# Altium schematic sheet Светодиоды.SchDoc
size 209 x 297 mm; Scale: 1:1; DocumentType: Схема электрическая принципиальная; FirstReferrence: АБВГ.123456.001
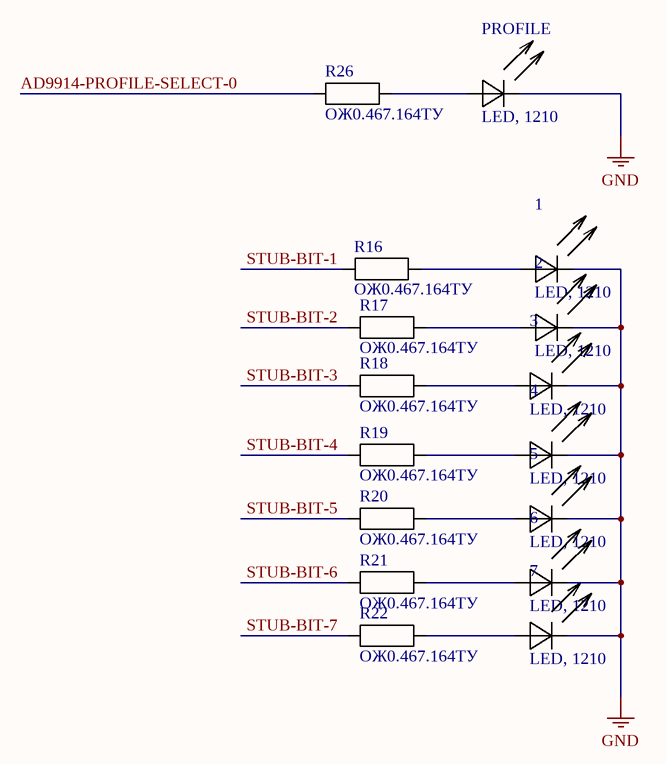
[diagram p0: Светодиоды.SchDoc]

## Parts
1  LED, 1210  [PLCC4-1210]
2  LED, 1210  [PLCC4-1210]
3  LED, 1210  [PLCC4-1210]
4  LED, 1210  [PLCC4-1210]
5  LED, 1210  [PLCC4-1210]
6  LED, 1210  [PLCC4-1210]
7  LED, 1210  [PLCC4-1210]
PROFILE  LED, 1210  [PLCC4-1210]
R16  ОЖ0.467.164ТУ  [Р1-8МП-0,125]
R17  ОЖ0.467.164ТУ  [Р1-8МП-0,125]
R18  ОЖ0.467.164ТУ  [Р1-8МП-0,125]
R19  ОЖ0.467.164ТУ  [Р1-8МП-0,125]
R20  ОЖ0.467.164ТУ  [Р1-8МП-0,125]
R21  ОЖ0.467.164ТУ  [Р1-8МП-0,125]
R22  ОЖ0.467.164ТУ  [Р1-8МП-0,125]
R26  ОЖ0.467.164ТУ  [Р1-8МП-0,125]

## Nets
GND: 1.2 2.2 3.2 4.2 5.2 6.2 7.2 PROFILE.2
AD9914-PROFILE-SELECT-0: R26.1
STUB-BIT-1: R16.1
STUB-BIT-2: R17.1
STUB-BIT-3: R18.1
STUB-BIT-4: R19.1
STUB-BIT-5: R20.1
STUB-BIT-6: R21.1
STUB-BIT-7: R22.1
Net1_1: 1.1 R16.2
Net2_1: 2.1 R17.2
Net3_1: 3.1 R18.2
Net4_1: 4.1 R19.2
Net5_1: 5.1 R20.2
Net6_1: 6.1 R21.2
Net7_1: 7.1 R22.2
NetPROFILE_1: PROFILE.1 R26.2

## Notes on the sheet
- Перв. примен.
- Справ. №
- Подп. и дата
- Инв. № дубл.
- Взам. инв. №
- Разраб.
- Изм.
- Лист
- № докум.
- Подп.
- Дата
- Лит.
- Масса
- Масштаб
- Пров.
- Т.контр.
- Листов
- Инв. № подл.
- Утв.
- Н.контр.
- 2.106-A4
- Копировал
- Формат А4

## Library data of the parts
1-7 PROFILE = 1210 LED: PartNumber: LED, 1210; Category: Диод; ManufacturerPartNumber: 1210 LED
R16-R22 R26 = Р1-8МП-0,125-100 Ом±1%: ManufacturerPartNumber: Р1-8МП-0,125-100 Ом±1%-0,5-Л; Value: 300 Ом; Tolerance: ±1%-0,5-Л; Power/Voltage: 0,125; Category: Резистор; PartNumber: ОЖ0.467.164ТУ